# Altium project Entc_demo.PrjPcb
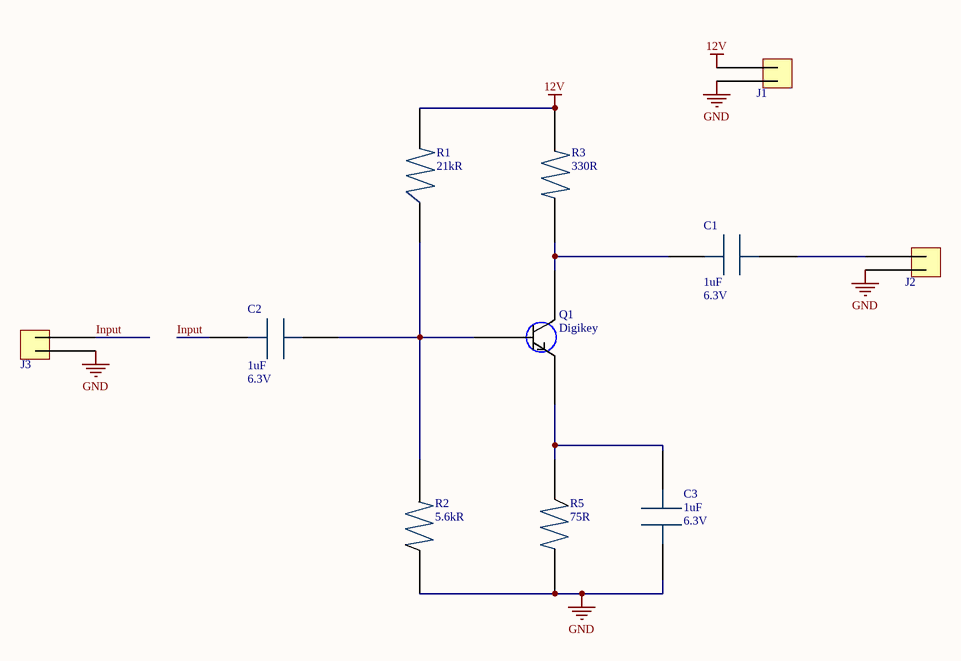
[diagram p0: Sheet1.SchDoc]
1 sheet, 11 parts. Net scope: global (net labels, ports and power ports of the same name join across sheets).
Board file: PCB1.PcbDoc

## Sheet Sheet1.SchDoc: BJT amplifeir
size A4; SheetNumber: 1; SheetTotal: 1

### Parts
C1  value 1uF  Voltage: 6.3V  [C0805C105K9RACTU]  (hidden comment: C0805C105K9RACTU)
C2  value 1uF  Voltage: 6.3V  [C0805C105K9RACTU]  (hidden comment: C0805C105K9RACTU)
C3  value 1uF  Voltage: 6.3V  [C0805C105K9RACTU]  (hidden comment: C0805C105K9RACTU)
J1  OSTTE020104  [OST_OSTTE020104]  (value not drawn)
J2  OSTTE020104  [OST_OSTTE020104]  (value not drawn)
J3  OSTTE020104  [OST_OSTTE020104]  (value not drawn)
Q1  Supplier: Digikey  [TO92127P476H533-3 - duplicate]  (hidden comment: BC547BBU)
R1  value 21kR  [RC0805FR-0721KL]  (hidden comment: RC0805FR-0721KL)
R2  value 5.6kR  [RC0805FR-075K6L]  (hidden comment: RC0805FR-075K6L)
R3  value 330R  [RC0805FR-07330RL]  (hidden comment: RC0805FR-07330RL)
R5  value 75R  [RC0805FR-0775RL]  (hidden comment: RC0805FR-0775RL)

### Nets
12V: J1.1 R1.2 R3.2
GND: C3.1 J1.2 J2.2 J3.1 R2.1 R5.2
Input: C2.2 J3.2
NetC1_1: C1.1 Q1.2 R3.1
NetC1_2: C1.2 J2.1
NetC2_1: C2.1 Q1.1 R1.1 R2.2
NetC3_2: C3.2 Q1.3 R5.1

### Notes on the sheet
- Title
- Size:
- Date:
- A4
- Number:
- Time:
- Revision:
- Sheet
- of
- File:

### Library data of the parts
C1-C3 = C0805C105K9RACTU: Ceramic Capacitor, Multilayer, Ceramic, 6.3V, 10% +Tol, 10% -Tol, X7R, 15% TC, 1uF, Surface Mount, 0805; Manufacturer: KEMET; Multilayer: Yes; Supplier: Digikey; Manufacturer Part Number: C0805C105K9RACTU; RoHS: Yes; Category: Ceramic Capacitors; Stock: 9671; Pricing: 1=0.13, 10=0.08, 100=0.0518, 1000=0.0363 (USD); Mounting Technology: Surface Mount; Pins: 2; Dielectric Material: Ceramic; Package Shape: Rectangular; Case/Package: 0805; Terminal Finish: Nickel; Min Operating Temperature: -55°C; Max Operating Temperature: 125°C; JESD-609 Code: e3; Capacitor Type: Ceramic; Tolerance  (fill in as +-): 10%; Package Style: SMTMeter; Packaging: Tape and Reel; Tolerance (fill in as +-): 10%; Temperature Characteristics Code: X7R; Termination: Wraparound; Length: 2mm; Width: 1.25mm; Height: 0.9mm; Reach SVHC Compliant: Yes; RoHS Compliant: Yes; ComponentLink1URL: https://datasheet.ciiva.com:443/pdfs/VipMasterIC/IC/KEME/KEME-S-A0008991654/KEME-S-A0008991654-1.pdf?src-supplier=IHS+Markit; ComponentLink1Description: Data Sheet; Supplier Part Number: 399-13161-1-ND
J1-J3 = OSTTE020104: Barrier Strip Terminal Block, 10A, 1 Row(s), 1 Deck(s); Manufacturer: On-Shore Technology; Fastening Method: SCREW; Additional Feature: STANDARD: UL 94V-0, THERMOPLASTIC; Number of Decks: 1; Number of Ways: 2; Voltage Rating: 125V; Wire/Cable Gauge: 16AWG; Safety Approval: UL,CUL; Supplier: Digikey; Supplier Part Number: ED2740-ND; Manufacturer Part Number: OSTTE020104; RoHS: Yes; Category: Terminal Blocks; Stock: 7767; Pricing: 1=0.48, 10=0.361, 25=0.3152, 50=0.2836, 100=0.2558, 250=0.225, 500=0.2061, 1000=0.19063, 5000=0.16559 (USD); Mounting Technology: Board; Number of Rows: 1; Current Rating: 10A; Terminal and Terminal Block Type: BARRIER STRIP TERMINAL BLOCK; Reach SVHC Compliant: Yes; RoHS Compliant: Yes; ComponentLink1URL: https://datasheet.ciiva.com:443/pdfs/VipMasterIC/IC/ONST/ONST-S-A0002844285/ONST-S-A0002844285-1.pdf?src-supplier=IHS+Markit; ComponentLink1Description: https://datasheet.ciiva.com:443/pdfs/VipMasterIC/IC/ONST/ONST-S-A0002844285/ONST-S-A0002844285-1.pdf?src-supplier=IHS+Markit; ComponentLink2URL: http://www.on-shore.com/wp-content/uploads/2015/09/osttexx0164.pdf?src-supplier=Verical; ComponentLink2Description: http://www.on-shore.com/wp-content/uploads/2015/09/osttexx0164.pdf?src-supplier=Verical; ComponentLink3URL: http://www.on-shore.com/wp-content/uploads/2015/09/osttexx0164.pdf?src-supplier=Digikey; ComponentLink3Description: http://www.on-shore.com/wp-content/uploads/2015/09/osttexx0164.pdf?src-supplier=Digikey; ComponentLink4URL: http://www.on-shore.com/wp-content/uploads/2015/09/osttexx0164.pdf?src-supplier=Arrow+Electronics; ComponentLink4Description: http://www.on-shore.com/wp-content/uploads/2015/09/osttexx0164.pdf?src-supplier=Arrow+Electronics
Q1 = BC547BBU: Small Signal Bipolar Transistor, 0.1A I(C), 45V V(BR)CEO, 1-Element, NPN, Silicon, TO-92; Manufacturer: ON Semiconductor / Fairchild; Package Body Material: Plastic; Max Collector Current: 100mA; DC Current Gain-Min (hFE): 200; Number of Elements: 1; Power Dissipation-Max (Abs): 625mW; Surface Mount: No; Transistor Application: SWITCHING; Frequency: 300MHz; Qualification Status: Not Qualified; Supplier Part Number: BC547BBU-ND; Manufacturer Part Number: BC547BBU; RoHS: Yes; Category: BJTs; Stock: 15923; Pricing: 1=0.27, 10=0.167, 100=0.1038, 500=0.07638, 1000=0.06748, 2000=0.05998, 5000=0.05184, 10000=0.04679, 50000=0.03795 (USD); Pins: 3; Package Shape: Round; Transistor Element Material: SILICON; Max Operating Temperature: 150°C; Polarity/Channel Type: NPN; Collector-emitter Voltage-Max: 45V; JESD-30 Code: O-PBCY-T3; Package Style: CYLINDRICALMeter; Terminal Form: Through Hole; Terminal Position: BOTTOM; Reach SVHC Compliant: Yes; RoHS Compliant: Yes; JEDEC-95 Code: TO-92; ComponentLink1URL: https://datasheet.ciiva.com:443/pdfs/VipMasterIC/IC/ONSM/ONSM-S-A0003590719/ONSM-S-A0003590719-1.pdf?src-supplier=IHS+Markit; ComponentLink1Description: https://datasheet.ciiva.com:443/pdfs/VipMasterIC/IC/ONSM/ONSM-S-A0003590719/ONSM-S-A0003590719-1.pdf?src-supplier=IHS+Markit; ComponentLink2URL: https://datasheet.ciiva.com/4722/bc547-4722533.pdf?src-supplier=Mouser; ComponentLink2Description: https://datasheet.ciiva.com/4722/bc547-4722533.pdf?src-supplier=Mouser; ComponentLink3URL: https://datasheet.ciiva.com/11197/bc550-11197481.pdf?src-supplier=Avnet; ComponentLink3Description: https://datasheet.ciiva.com/11197/bc550-11197481.pdf?src-supplier=Avnet; ComponentLink4URL: https://datasheet.ciiva.com/46415/1868820-46415436.pdf?src-supplier=Element14; ComponentLink4Description: https://datasheet.ciiva.com/46415/1868820-46415436.pdf?src-supplier=Element14; ComponentLink5URL: https://datasheet.ciiva.com/978/bc546-978999.pdf?src-supplier=Digikey; ComponentLink5Description: https://datasheet.ciiva.com/978/bc546-978999.pdf?src-supplier=Digikey; ComponentLink6URL: https://datasheet.ciiva.com/17179/bc547-17179695.pdf?src-supplier=Future+Electronics; ComponentLink6Description: https://datasheet.ciiva.com/17179/bc547-17179695.pdf?src-supplier=Future+Electronics
R1 = RC0805FR-0721KL: Fixed Resistor, Metal Glaze/thick Film, 0.125W, 21000ohm, 150V, 1% +/-Tol, 100ppm/Cel, Surface Mount, 0805; Manufacturer: Yageo; Additional Feature: LASER TRIMMABLE; Power: 125mW; Rated Temperature: 70°C; Temperature Coefficient (ppm/Cel): 100; Package Height: 0.5mm; Package Length: 2mm; Package Width: 1.25mm; Supplier: Digikey; Supplier Part Number: 311-21.0KCRCT-ND; Manufacturer Part Number: RC0805FR-0721KL; RoHS: Yes; Category: Chip SMD Resistors; Stock: 156; Pricing: 1=0.1, 10=0.011, 100=0.0092 (USD); Mounting Technology: Surface Mount; Pins: 2; Package Shape: Rectangular; Case/Package: 0805; Terminal Finish: Nickel; Min Operating Temperature: -55°C; Max Operating Temperature: 155°C; Tolerance: 1%; JESD-609 Code: e3; Resistor Type: FIXED RESISTOR; Construction: Chip; Packaging: Tape and Reel; Technology: METAL GLAZE/THICK FILM; Termination: Wraparound; Working Voltage: 150V; Reach SVHC Compliant: Yes; RoHS Compliant: Yes; ComponentLink1URL: https://datasheet.ciiva.com:443/pdfs/VipMasterIC/IC/YAGO/YAGO-S-A0008145938/YAGO-S-A0008145938-1.pdf?src-supplier=IHS+Markit; ComponentLink1Description: https://datasheet.ciiva.com:443/pdfs/VipMasterIC/IC/YAGO/YAGO-S-A0008145938/YAGO-S-A0008145938-1.pdf?src-supplier=IHS+Markit; ComponentLink2URL: https://datasheet.ciiva.com/2519/pyu-r-int-thick-7-2519837.pdf?src-supplier=Digikey; ComponentLink2Description: https://datasheet.ciiva.com/2519/pyu-r-int-thick-7-2519837.pdf?src-supplier=Digikey; ComponentLink3URL: https://datasheet.ciiva.com/2519/pyu-r-int-thick-7-2519838.pdf?src-supplier=Digikey; ComponentLink3Description: https://datasheet.ciiva.com/2519/pyu-r-int-thick-7-2519838.pdf?src-supplier=Digikey; ComponentLink4URL: https://datasheet.ciiva.com/2519/pyu-r-int-thick-7-2519839.pdf?src-supplier=Digikey; ComponentLink4Description: https://datasheet.ciiva.com/2519/pyu-r-int-thick-7-2519839.pdf?src-supplier=Digikey; ComponentLink5URL: https://datasheet.ciiva.com/12558/rc0805-257173-12558585.pdf?src-supplier=Mouser; ComponentLink5Description: https://datasheet.ciiva.com/12558/rc0805-257173-12558585.pdf?src-supplier=Mouser; ComponentLink6URL: https://datasheet.ciiva.com/16742/rc0805-16742250.pdf?src-supplier=Future+Electronics; ComponentLink6Description: https://datasheet.ciiva.com/16742/rc0805-16742250.pdf?src-supplier=Future+Electronics
R2 = RC0805FR-075K6L: Fixed Resistor, Metal Glaze/thick Film, 0.125W, 5600ohm, 150V, 1% +/-Tol, 100ppm/Cel, Surface Mount, 0805; Manufacturer: Yageo; Additional Feature: LASER TRIMMABLE; Power: 125mW; Rated Temperature: 70°C; Temperature Coefficient (ppm/Cel): 100; Package Height: 0.5mm; Package Length: 2mm; Package Width: 1.25mm; Supplier: Digikey; Supplier Part Number: 311-5.60KCRCT-ND; Manufacturer Part Number: RC0805FR-075K6L; RoHS: Yes; Category: Chip SMD Resistors; Stock: 43155; Pricing: 1=0.1, 10=0.014, 100=0.0112, 1000=0.00918, 2500=0.00686 (USD); Mounting Technology: Surface Mount; Pins: 2; Package Shape: Rectangular; Case/Package: 0805; Terminal Finish: Nickel; Min Operating Temperature: -55°C; Max Operating Temperature: 155°C; Tolerance: 1%; JESD-609 Code: e3; Resistor Type: FIXED RESISTOR; Construction: Chip; Packaging: Tape and Reel; Technology: METAL GLAZE/THICK FILM; Termination: Wraparound; Working Voltage: 150V; Reach SVHC Compliant: Yes; RoHS Compliant: Yes; ComponentLink1URL: https://datasheet.ciiva.com:443/pdfs/VipMasterIC/IC/YAGO/YAGO-S-A0008145938/YAGO-S-A0008145938-1.pdf?src-supplier=IHS+Markit; ComponentLink1Description: https://datasheet.ciiva.com:443/pdfs/VipMasterIC/IC/YAGO/YAGO-S-A0008145938/YAGO-S-A0008145938-1.pdf?src-supplier=IHS+Markit; ComponentLink2URL: https://datasheet.ciiva.com/2519/pyu-r-int-thick-7-2519845.pdf?src-supplier=Digikey; ComponentLink2Description: https://datasheet.ciiva.com/2519/pyu-r-int-thick-7-2519845.pdf?src-supplier=Digikey; ComponentLink3URL: https://datasheet.ciiva.com/2519/pyu-r-int-thick-7-2519843.pdf?src-supplier=Digikey; ComponentLink3Description: https://datasheet.ciiva.com/2519/pyu-r-int-thick-7-2519843.pdf?src-supplier=Digikey; ComponentLink4URL: https://datasheet.ciiva.com/7941/444164-7941819.pdf?src-supplier=Element14; ComponentLink4Description: https://datasheet.ciiva.com/7941/444164-7941819.pdf?src-supplier=Element14; ComponentLink5URL: https://datasheet.ciiva.com/7941/444164-7941820.pdf?src-supplier=Element14; ComponentLink5Description: https://datasheet.ciiva.com/7941/444164-7941820.pdf?src-supplier=Element14; ComponentLink6URL: https://datasheet.ciiva.com/2519/pyu-r-int-thick-7-2519844.pdf?src-supplier=Digikey; ComponentLink6Description: https://datasheet.ciiva.com/2519/pyu-r-int-thick-7-2519844.pdf?src-supplier=Digikey
R3 = RC0805FR-07330RL: Fixed Resistor, Metal Glaze/thick Film, 0.125W, 330ohm, 150V, 1% +/-Tol, 100ppm/Cel, Surface Mount, 0805; Manufacturer: Yageo; Additional Feature: LASER TRIMMABLE; Power: 125mW; Rated Temperature: 70°C; Temperature Coefficient (ppm/Cel): 100; Package Height: 0.5mm; Package Length: 2mm; Package Width: 1.25mm; Supplier: Digikey; Supplier Part Number: 311-330CRCT-ND; Manufacturer Part Number: RC0805FR-07330RL; RoHS: Yes; Category: Chip SMD Resistors; Stock: 211766; Pricing: 1=0.1, 10=0.011, 100=0.0102, 1000=0.00816, 2500=0.00686 (USD); Mounting Technology: Surface Mount; Pins: 2; Package Shape: Rectangular; Case/Package: 0805; Terminal Finish: Nickel; Min Operating Temperature: -55°C; Max Operating Temperature: 155°C; Tolerance: 1%; JESD-609 Code: e3; Termination: Wraparound; Resistor Type: FIXED RESISTOR; Construction: Chip; Packaging: Tape and Reel; Technology: METAL GLAZE/THICK FILM; Working Voltage: 150V; Reach SVHC Compliant: Yes; RoHS Compliant: Yes; ComponentLink1URL: https://datasheet.ciiva.com:443/pdfs/VipMasterIC/IC/YAGO/YAGO-S-A0008145938/YAGO-S-A0008145938-1.pdf?src-supplier=IHS+Markit; ComponentLink1Description: https://datasheet.ciiva.com:443/pdfs/VipMasterIC/IC/YAGO/YAGO-S-A0008145938/YAGO-S-A0008145938-1.pdf?src-supplier=IHS+Markit; ComponentLink2URL: https://datasheet.ciiva.com/12667/rc0805-12667925.pdf?src-supplier=Mouser; ComponentLink2Description: https://datasheet.ciiva.com/12667/rc0805-12667925.pdf?src-supplier=Mouser; ComponentLink3URL: https://datasheet.ciiva.com/7941/444164-7941768.pdf?src-supplier=Element14; ComponentLink3Description: https://datasheet.ciiva.com/7941/444164-7941768.pdf?src-supplier=Element14; ComponentLink4URL: https://datasheet.ciiva.com/7941/444164-7941769.pdf?src-supplier=Element14; ComponentLink4Description: https://datasheet.ciiva.com/7941/444164-7941769.pdf?src-supplier=Element14; ComponentLink5URL: https://datasheet.ciiva.com/2457/pyu-r-int-thick-7-2457014.pdf?src-supplier=Digikey; ComponentLink5Description: https://datasheet.ciiva.com/2457/pyu-r-int-thick-7-2457014.pdf?src-supplier=Digikey; ComponentLink6URL: https://datasheet.ciiva.com/2457/pyu-r-int-thick-7-2457015.pdf?src-supplier=Digikey; ComponentLink6Description: https://datasheet.ciiva.com/2457/pyu-r-int-thick-7-2457015.pdf?src-supplier=Digikey; ComponentLink7URL: https://datasheet.ciiva.com/2457/pyu-r-int-thick-7-2457016.pdf?src-supplier=Digikey; ComponentLink7Description: https://datasheet.ciiva.com/2457/pyu-r-int-thick-7-2457016.pdf?src-supplier=Digikey; ComponentLink8URL: https://datasheet.ciiva.com/16740/rc0805-16740975.pdf?src-supplier=Future+Electronics; ComponentLink8Description: https://datasheet.ciiva.com/16740/rc0805-16740975.pdf?src-supplier=Future+Electronics
R5 = RC0805FR-0775RL: Fixed Resistor, Metal Glaze/thick Film, 0.125W, 75ohm, 150V, 1% +/-Tol, 100ppm/Cel, Surface Mount, 0805; Manufacturer: Yageo; Additional Feature: LASER TRIMMABLE; Power: 125mW; Rated Temperature: 70°C; Temperature Coefficient (ppm/Cel): 100; Package Height: 0.5mm; Package Length: 2mm; Package Width: 1.25mm; Supplier: Digikey; Supplier Part Number: 311-75.0CRCT-ND; Manufacturer Part Number: RC0805FR-0775RL; RoHS: Yes; Category: Chip SMD Resistors; Stock: 349214; Pricing: 1=0.1, 10=0.012, 100=0.0102, 1000=0.00816, 2500=0.00686 (USD); Mounting Technology: Surface Mount; Pins: 2; Package Shape: Rectangular; Case/Package: 0805; Terminal Finish: Nickel; Min Operating Temperature: -55°C; Max Operating Temperature: 155°C; Tolerance: 1%; JESD-609 Code: e3; Resistor Type: FIXED RESISTOR; Construction: Chip; Packaging: Tape and Reel; Technology: METAL GLAZE/THICK FILM; Termination: Wraparound; Working Voltage: 150V; Reach SVHC Compliant: Yes; RoHS Compliant: Yes; ComponentLink1URL: https://datasheet.ciiva.com:443/pdfs/VipMasterIC/IC/YAGO/YAGO-S-A0008145938/YAGO-S-A0008145938-1.pdf?src-supplier=IHS+Markit; ComponentLink1Description: https://datasheet.ciiva.com:443/pdfs/VipMasterIC/IC/YAGO/YAGO-S-A0008145938/YAGO-S-A0008145938-1.pdf?src-supplier=IHS+Markit; ComponentLink2URL: https://datasheet.ciiva.com/2519/pyu-r-int-thick-7-2519706.pdf?src-supplier=Digikey; ComponentLink2Description: https://datasheet.ciiva.com/2519/pyu-r-int-thick-7-2519706.pdf?src-supplier=Digikey; ComponentLink3URL: https://datasheet.ciiva.com/2519/pyu-r-int-thick-7-2519707.pdf?src-supplier=Digikey; ComponentLink3Description: https://datasheet.ciiva.com/2519/pyu-r-int-thick-7-2519707.pdf?src-supplier=Digikey